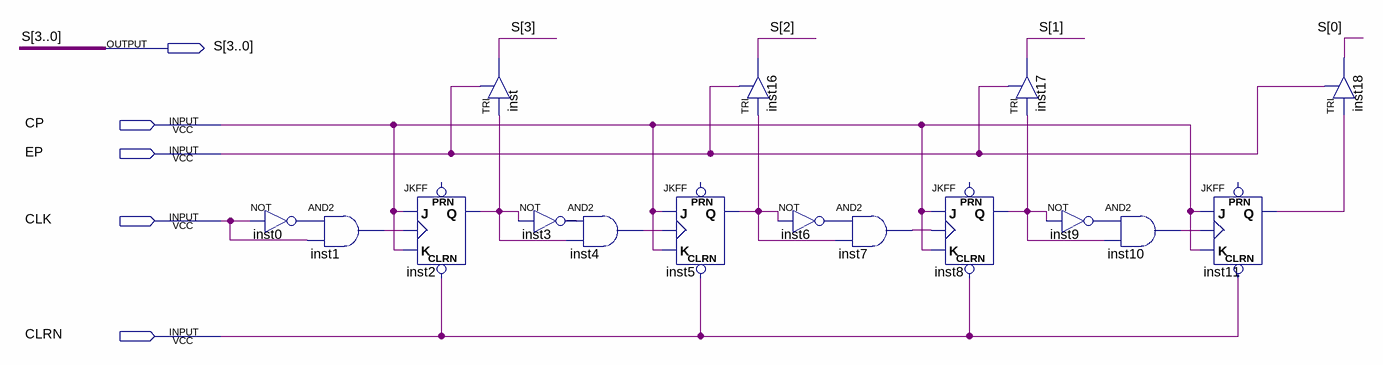
[diagram p0: schematic sheet]
// Quartus schematic Contador_Programa.bdf as structural Verilog: 16 symbols, 5 pins
module Contador_Programa (
  input  CP,
  input  EP,
  input  CLK,
  input  CLRN,
  output [3:0] S
);

  wire inst0_out, inst1_out, inst2_q, inst3_out, inst4_out, inst5_q, inst6_out, inst7_out, inst8_q,
       inst9_out, inst10_out, inst11_q;

  not inst0 (inst0_out, CLK);
  and inst1 (inst1_out, inst0_out, CLK);
  JKFF inst2 (.CLRN(CLRN), .K(CP), .J(CP), .CLK(inst1_out), .Q(inst2_q));  // open: PRN
  TRI inst (.IN(inst2_q), .OE(EP), .OUT(S[3]));
  not inst3 (inst3_out, inst2_q);
  and inst4 (inst4_out, inst3_out, inst2_q);
  JKFF inst5 (.CLRN(CLRN), .K(CP), .J(CP), .CLK(inst4_out), .Q(inst5_q));  // open: PRN
  TRI inst16 (.IN(inst5_q), .OE(EP), .OUT(S[2]));
  not inst6 (inst6_out, inst5_q);
  and inst7 (inst7_out, inst6_out, inst5_q);
  JKFF inst8 (.CLRN(CLRN), .K(CP), .J(CP), .CLK(inst7_out), .Q(inst8_q));  // open: PRN
  TRI inst17 (.IN(inst8_q), .OE(EP), .OUT(S[1]));
  not inst9 (inst9_out, inst8_q);
  and inst10 (inst10_out, inst9_out, inst8_q);
  JKFF inst11 (.CLRN(CLRN), .K(CP), .J(CP), .CLK(inst10_out), .Q(inst11_q));  // open: PRN
  TRI inst18 (.IN(inst11_q), .OE(EP), .OUT(S[0]));
endmodule
